# EAGLE design controller (EAGLE 6.2)
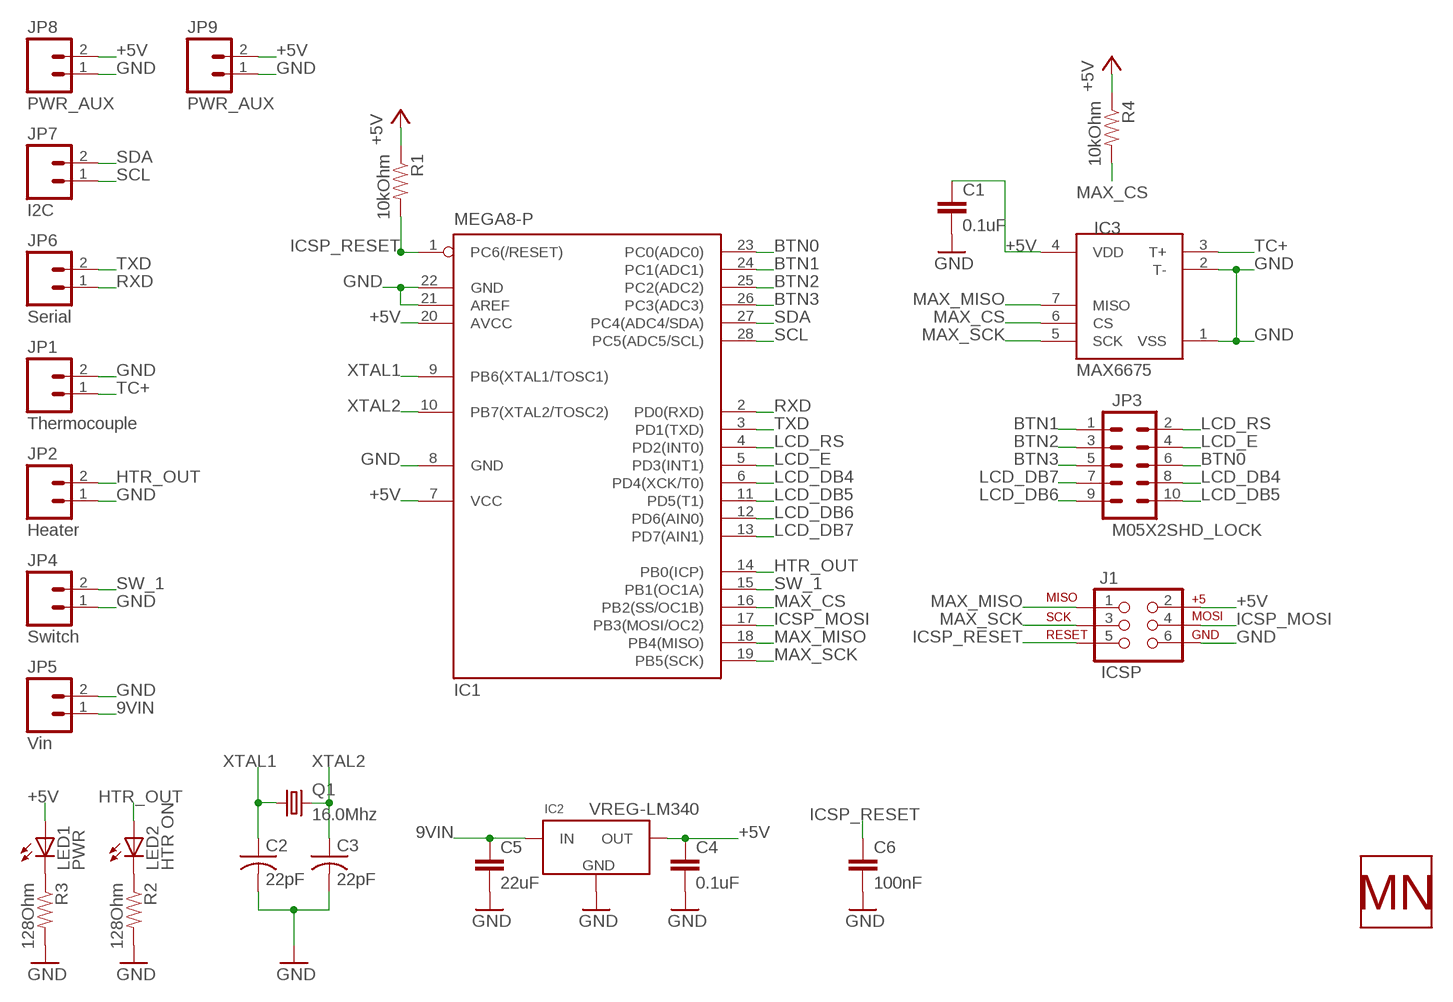
[diagram p0: schematic, sheet 1]

## Parts
C1  0.1uF  CAPPTH  [CAP-PTH-SMALL]
C2  22pF  C-US025-030X050  [C025-030X050]
C3  22pF  C-US025-030X050  [C025-030X050]
C4  0.1uF  CAPPTH  [CAP-PTH-SMALL]
C5  22uF  CAPPTH1  [CAP-PTH-5MM]
C6  100nF  CAP0603-CAP  [0603-CAP]
IC1  MEGA8-P  [DIL28-3]
IC2  VREG-LM340  [D2PACK/A]
IC3  MAX6675  [SO08-MAX6675]
J1  ICSP  AVR_SPI_PRG_6PTH  [2X3]
JP1  Thermocouple  M025MM  [SCREWTERMINAL-5MM-2]
JP2  Heater  M025MM  [SCREWTERMINAL-5MM-2]
JP3  M05X2SHD_LOCK  [2X5-SHROUDED_LOCK]
JP4  Switch  M025MM  [SCREWTERMINAL-5MM-2]
JP5  Vin  M025MM  [SCREWTERMINAL-5MM-2]
JP6  Serial  M02PTH  [1X02]
JP7  I2C  M02PTH  [1X02]
JP8  PWR_AUX  M02PTH  [1X02]
JP9  PWR_AUX  M02POLAR  [MOLEX-1X2]
LED1  PWR  LED-GREEN0603  [LED-0603]
LED2  HTR ON  LED-RED0603  [LED-0603]
Q1  16.0Mhz  CRYSTALHC49S  [HC49/S]
R1  10kOhm  RESISTOR1206  [1206]
R2  128Ohm  RESISTOR1206  [1206]
R3  128Ohm  RESISTOR1206  [1206]
R4  10kOhm  RESISTOR1206  [1206]
U$1  MN-LOGO  [MN-LOGO]

## Nets
9VIN [POWER]: C5.1 IC2.1(IN) JP5.1
+5V: C1.1 C4.1 IC1.7(VCC) IC1.20(AVCC) IC2.3(OUT) IC3.4(VDD) J1.2 JP8.2 JP9.2 LED1.A R1.1 R4.1
BTN0: IC1.23(PC0(ADC0)) JP3.6
BTN1: IC1.24(PC1(ADC1)) JP3.1
BTN2: IC1.25(PC2(ADC2)) JP3.3
BTN3: IC1.26(PC3(ADC3)) JP3.5
GND: C1.2 C2.2 C3.2 C4.2 C5.2 C6.2 IC1.8(GND) IC1.21(AREF) IC1.22(GND) IC2.2(GND) IC2.TAB(GND) IC3.1(VSS) IC3.2(T-) J1.6 JP1.2 JP2.1 JP4.1 JP5.2 JP8.1 JP9.1 R2.2 R3.2
HTR_OUT: IC1.14(PB0(ICP)) JP2.2 LED2.A
ICSP_MOSI: IC1.17(PB3(MOSI/OC2)) J1.4
ICSP_RESET: C6.1 IC1.1(PC6(/RESET)) J1.5 R1.2
LCD_DB4: IC1.6(PD4(XCK/T0)) JP3.8
LCD_DB5: IC1.11(PD5(T1)) JP3.10
LCD_DB6: IC1.12(PD6(AIN0)) JP3.9
LCD_DB7: IC1.13(PD7(AIN1)) JP3.7
LCD_E: IC1.5(PD3(INT1)) JP3.4
LCD_RS: IC1.4(PD2(INT0)) JP3.2
MAX_CS: IC1.16(PB2(SS/OC1B)) IC3.6(CS) R4.2
MAX_MISO: IC1.18(PB4(MISO)) IC3.7(MISO) J1.1
MAX_SCK: IC1.19(PB5(SCK)) IC3.5(SCK) J1.3
N$1: LED1.C R3.1
N$4: LED2.C R2.1
RXD: IC1.2(PD0(RXD)) JP6.1
SCL: IC1.28(PC5(ADC5/SCL)) JP7.1
SDA: IC1.27(PC4(ADC4/SDA)) JP7.2
SW_1: IC1.15(PB1(OC1A)) JP4.2
TC+: IC3.3(T+) JP1.1
TXD: IC1.3(PD1(TXD)) JP6.2
XTAL1: C2.1 IC1.9(PB6(XTAL1/TOSC1)) Q1.1
XTAL2: C3.1 IC1.10(PB7(XTAL2/TOSC2)) Q1.2

## Library data of the parts
C1 C4 = SparkFun-Passives:CAP: Capacitor Standard 0603 ceramic capacitor, and 0.1" leaded capacitor.
C2 C3 = rcl:C-US: CAPACITOR, American symbol
C5 C6 = SparkFun-Capacitors:CAP: Capacitor Standard 0603 ceramic capacitor, and 0.1" leaded capacitor.
IC1 = atmel:MEGA8-P: MICROCONTROLLER 8 Kbytes FLASH, 1 kbytes SRAM, 512 bytes EEPROM, USART, 4-channel 10 bit ADC, 2-channel 8 bit ADC Pin compatible with Atmega48, ATMega88, ATMega168 Source: avr.lbr; OC_FARNELL: unknown; OC_NEWARK: unknown
IC2 = Mikes-Power-IC:VREG-LM340
IC3 = SparkFun-AnalogIC:MAX6675: K-type thermocouple ADC, SPI output
J1 = SparkFun-Connectors:AVR_SPI_PRG_6: AVR ISP 6 Pin This is the reduced ISP connector for AVR programming. Common on Arduino. This footprint will take up less PCB space and can be used with a 10-pin to 6-pin adapter such as SKU: BOB-08508
JP1 JP2 JP4-JP9 = SparkFun-Connectors:M02: Header 2 Standard 2-pin 0.1" header. Use with straight break away headers (SKU : PRT-00116), right angle break away headers (PRT-00553), swiss pins (PRT-00743), machine pins (PRT-00117), and female headers (PRT-00115). Molex polarized connector foot print use with SKU : PRT-08233 with associated crimp pins and housings.
JP3 = SparkFun-Connectors:M05X2: Header 5x2 Standard 10-pin dual row 0.1" header. Commonly used with AVR-ISP. Use with Spark Fun Electronics SKU: PRT-00778
LED1 = SparkFun-LED:LED-GREEN: Various green LEDs 0603- DIO-00821 LARGE- DIO-00862 LILYPAD- DIO-09910; PROD_ID: DIO-00821; VALUE: GREEN
LED2 = SparkFun-LED:LED-RED: Assorted Red LEDs LilyPad 1206- DIO-09912 1206- DIO-00809 0603- DIO-00819; PROD_ID: DIO-00819; VALUE: RED
Q1 = crystal:CRYSTAL: CRYSTAL; OC_FARNELL: 1667008; OC_NEWARK: unknown
R1-R4 = SparkFun-Resistors:RESISTOR: Resistor Basic schematic elements and footprints for 0603, 1206, and PTH resistors.
U$1 = Mikes-Aesthetics:MN-LOGO: Simple Logo with my initials

## Net classes
0 default: width 0.254 mm, drill 0.508 mm, clearance 0.254 mm
1 POWER: width 0.406 mm, drill 0.508 mm, clearance 0.254 mm

## Board
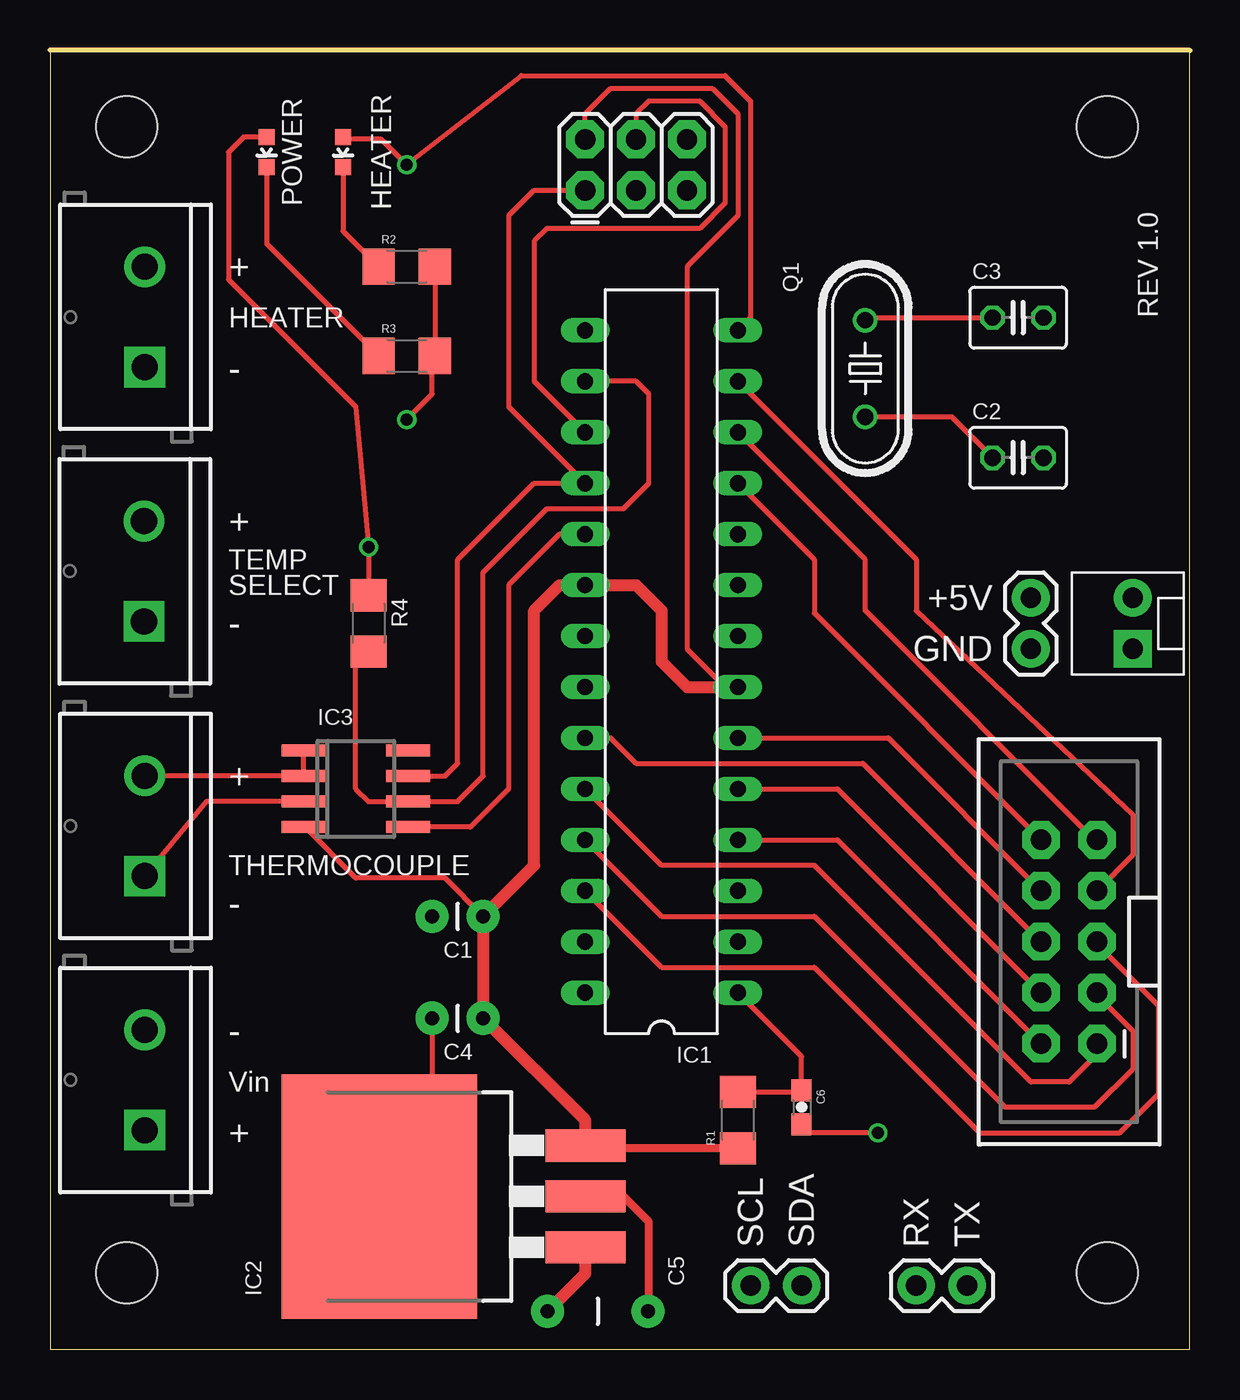
[diagram p1: board, top side]
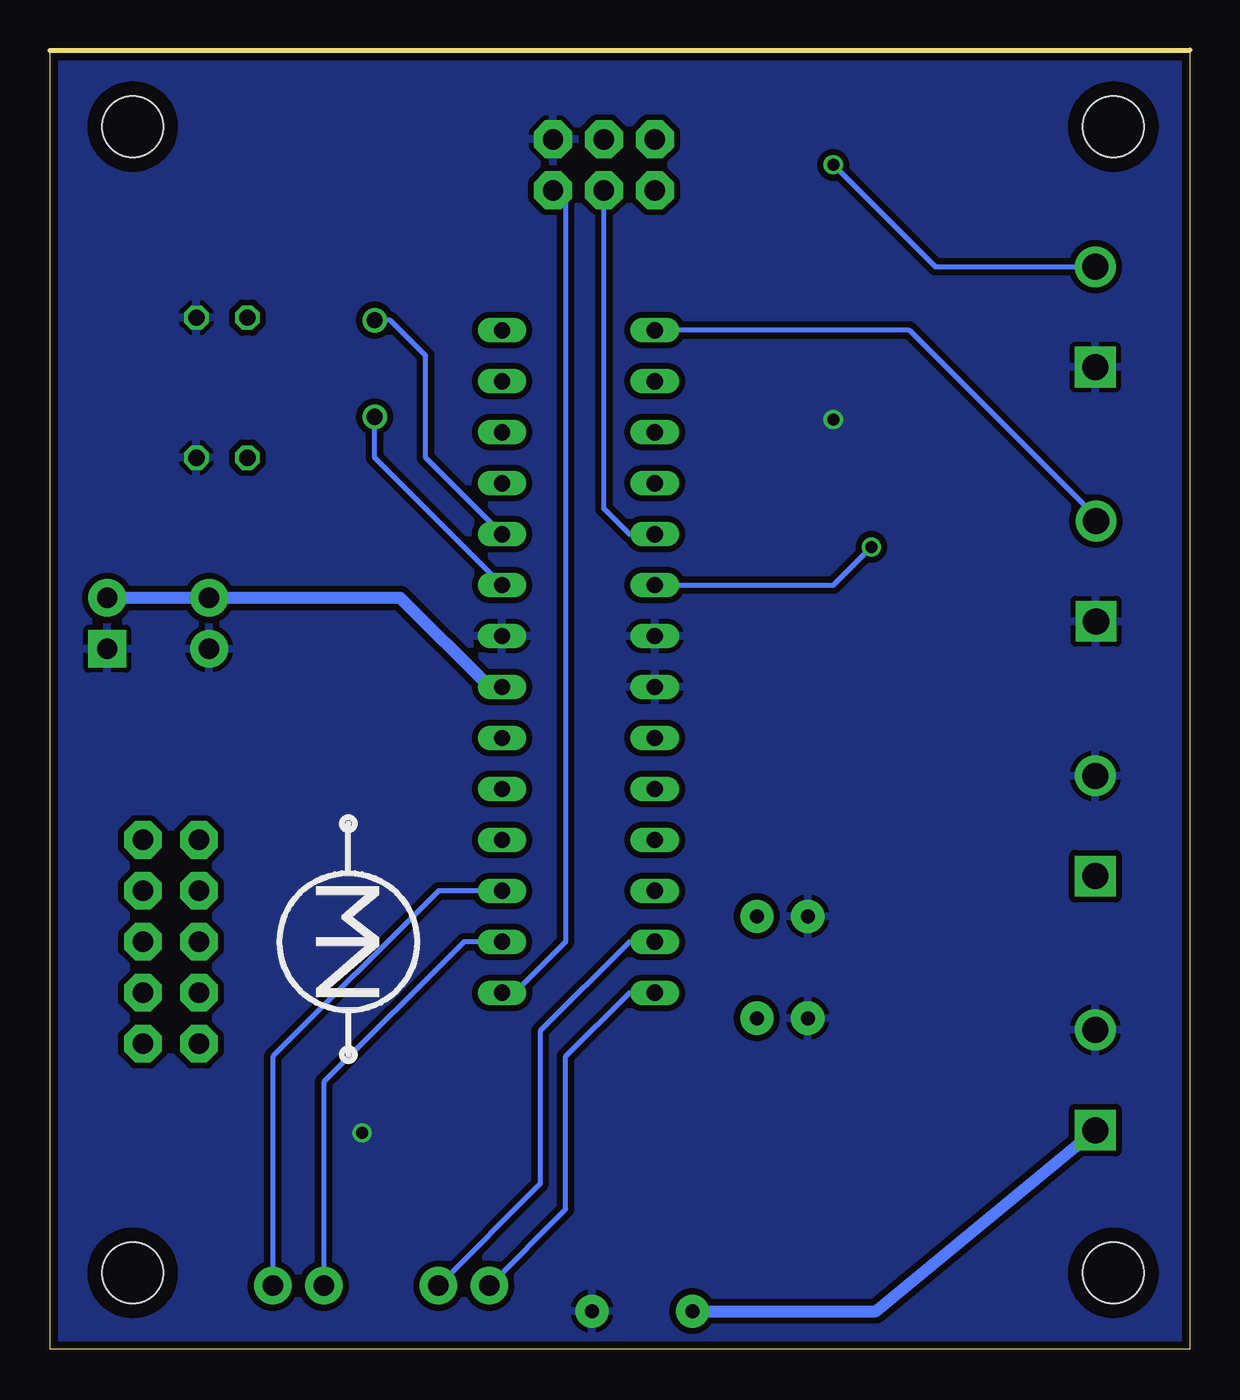
[diagram p2: board, bottom side, seen from below]

Size 56.82 x 64.77 mm. Coordinates in mm from the lower left corner, seen from the top.
Outline: 0,0 56.82,0 56.82,64.76 0,64.77 0,0
Copper layers (1*16): Top 0.0356mm / dielectric 1.5011mm / Bottom 0.0356mm
Design rules: minimum track width 6mil, minimum drill 13mil, track to track 6mil, track to pad 6mil, pad to pad 6mil, via to via 6mil, smd to smd 6mil, copper to edge 15mil, drill to drill 6mil, minimum pad ring 7mil, minimum via ring 7mil, stop-mask expansion 4mil, vias tented up to drill 0mil, thermal gap 10mil

### Footprints (pad centres in the part's own frame; a part is rotated, then mirrored left to right if it is on the bottom)
CAP-PTH-SMALL = drill 0.7 pad 1.651: 1 0,0; 2 2.54,0
C025-030X050 = drill 0.813 octagon: 1 -1.27,0; 2 1.27,0
CAP-PTH-5MM = drill 0.7 pad 1.651: 1 -2.5,0; 2 2.5,0
0603-CAP = smd 1.1 x 1: 1 -0.85,0; 2 0.85,0
DIL28-3 = drill 0.813 long: 1 -16.51,-3.81; 2 -13.97,-3.81; 3 -11.43,-3.81; 4 -8.89,-3.81; 5 -6.35,-3.81; 6 -3.81,-3.81; 7 -1.27,-3.81; 8 1.27,-3.81; 9 3.81,-3.81; 10 6.35,-3.81; 11 8.89,-3.81; 12 11.43,-3.81; 13 13.97,-3.81; 14 16.51,-3.81; 15 16.51,3.81; 16 13.97,3.81; 17 11.43,3.81; 18 8.89,3.81; 19 6.35,3.81; 20 3.81,3.81; 21 1.27,3.81; 22 -1.27,3.81; 23 -3.81,3.81; 24 -6.35,3.81; 25 -8.89,3.81; 26 -11.43,3.81; 27 -13.97,3.81; 28 -16.51,3.81
D2PACK/A = smd 1.6 x 4: 1 -2.54,-8.275; 2 0,-8.275; 3 2.54,-8.275 | smd 12.2 x 9.75: TAB 0,2
SO08-MAX6675 = smd 0.6 x 2.2: 1 -1.905,-2.6; 2 -0.635,-2.6; 3 0.635,-2.6; 4 1.905,-2.6; 5 1.905,2.6; 6 0.635,2.6; 7 -0.635,2.6; 8 -1.905,2.6
2X3 = drill 1.016 pad 1.88 octagon: 1 0,0; 2 0,2.54; 3 2.54,0; 4 2.54,2.54; 5 5.08,0; 6 5.08,2.54
SCREWTERMINAL-5MM-2 = drill 1.3 pad 2.032 square: 1 0,0 | drill 1.3 pad 2.032: 2 5,0
2X5-SHROUDED_LOCK = drill 1.016 pad 1.88 octagon: 1 -1.397,5.08; 2 1.397,5.08; 3 -1.397,2.54; 4 1.397,2.54; 5 -1.397,0; 6 1.397,0; 7 -1.397,-2.54; 8 1.397,-2.54; 9 -1.397,-5.08; 10 1.397,-5.08
1X02 = drill 1.016 pad 1.88: 1 0,0; 2 2.54,0
MOLEX-1X2 = drill 1.016 pad 1.88 square: 1 0,0 | drill 1.016 pad 1.88: 2 2.54,0
LED-0603 = smd 0.8 x 0.8: A 0,-0.75; C 0,0.75
HC49/S = drill 0.813: 1 -2.413,0; 2 2.413,0
1206 = smd 1.6 x 1.8: 1 -1.4,0; 2 1.4,0
STAND-OFF-TIGHT = hole 3.048: 0,0

### Placement (x,y rotation side)
C1  21.59,21.59 180 top
C2  48.26,44.45 0 top
C3  48.26,51.44 0 top
C4  21.59,16.51 180 top
C5  27.3,1.91 0 top
C6  37.47,12.06 270 top
IC1  30.48,34.29 90 top
IC2  18.41,7.62 90 top
IC3  15.24,27.94 270 top
J1  26.67,57.78 0 top
JP1  4.71,23.59 90 top
JP2  4.71,48.97 90 top
JP3  50.8,20.32 180 top
JP4  4.68,36.29 90 top
JP5  4.71,10.93 90 top
JP6  43.18,3.17 0 top
JP7  34.92,3.17 0 top
JP8  48.9,34.92 90 top
JP9  53.98,34.92 90 top
LED1  10.79,59.69 180 top
LED2  14.61,59.69 180 top
Q1  40.64,48.9 90 top
R1  34.29,11.43 90 top
R2  17.78,53.98 0 top
R3  17.78,49.53 0 top
R4  15.88,36.2 270 top
U$1  41.91,20.32 270 bottom
U$2  [STAND-OFF-TIGHT]  3.81,60.96 0 top
U$3  [STAND-OFF-TIGHT]  3.81,3.81 0 top
U$4  [STAND-OFF-TIGHT]  52.7,60.96 0 top
U$5  [STAND-OFF-TIGHT]  52.7,3.81 90 top

### Tracks (layer width: path | path; a pad name or v marks a point on that pad's centre or on a via)
9VIN
  Top 0.61: C5.1 26.69,3.79 IC2.1
  Bottom 0.61: C5.1 15.64,1.91 JP5.1
+5V  (via drill 0.6)
  Top 0.254: C1.1 19.68,23.5 15.24,23.5 12.7,26.04 IC3.4 | R4.1 v15.88,40.01 15.24,46.99 8.89,53.34 8.89,59.69 9.64,60.44 LED1.A | J1.2 26.67,61.59 27.94,62.87 33.02,62.87 34.29,61.59 34.29,56.52 31.75,53.98 31.75,34.92 33.66,33.02
  Top 0.406: R1.1 26.82,10.03 IC2.3
  Top 0.61: IC1.7 33.66,33.02 31.75,33.02 30.48,34.29 30.48,36.83 29.21,38.1 IC1.20 25.4,38.1 24.13,36.83 24.13,24.13 C1.1 C4.1 26.69,11.41 IC2.3
  Bottom 0.254: IC1.20 17.78,38.1 v15.88,40.01
  Bottom 0.61: IC1.7 34.92,33.02 39.37,37.47 JP8.2 JP9.2
BTN0
  Top 0.254: IC1.23 27.94,30.48 29.21,29.21 40.51,29.21 JP3.6
BTN1
  Top 0.254: JP3.1 52.2,14.73 50.8,13.34 48.9,13.34 38.1,24.13 30.48,24.13 IC1.24
BTN2
  Top 0.254: IC1.25 30.48,21.59 38.1,21.59 47.62,12.06 52.07,12.06 53.98,13.97 53.98,15.88 52.2,17.65 JP3.3
BTN3
  Top 0.254: IC1.26 30.48,19.05 38.1,19.05 46.35,10.79 53.34,10.79 55.24,12.7 55.24,17.14 52.2,20.19 JP3.5
GND  (via drill 0.6)
  Top 0.254: C4.2 19.05,8.89 16.51,6.35 16.51,7.53 IC2.TAB | C5.2 29.84,1.95 | 28.57,7.62 IC2.2 | IC3.1 IC3.2 5.37,28.57 JP1.2 | R2.2 R3.2 19.05,49.4 19.05,47.62 v17.78,46.35 | v41.27,10.79 37.88,10.79 C6.2
  Top 0.406: 29.84,1.95 29.84,6.35 28.57,7.62
  pour Bottom (isolate 0.305): -0.64,65.41 57.78,65.41 57.78,-0.64 -0.64,-0.64
HTR_OUT  (via drill 0.6)
  Top 0.254: LED2.A 14.72,60.33 16.51,60.33 v17.78,59.05 23.5,63.5 33.66,63.5 34.92,62.23 34.92,51.44 IC1.14
  Bottom 0.254: v17.78,59.05 12.69,53.97 JP2.2
ICSP_MOSI
  Top 0.254: IC1.17 24.13,48.26 24.13,55.24 24.77,55.88 32.38,55.88 33.66,57.15 33.66,60.96 32.38,62.23 29.84,62.23 29.21,61.59 J1.4
ICSP_RESET
  Top 0.254: IC1.1 37.47,14.61 C6.1 37.38,12.83 R1.2
  Bottom 0.254: IC1.1 33.66,17.78 31.11,20.32 31.11,57.15 J1.5
LCD_DB4
  Top 0.254: IC1.6 41.78,30.48 JP3.8
LCD_DB5
  Top 0.254: IC1.11 38.1,39.37 38.1,36.7 JP3.10
LCD_DB6
  Top 0.254: JP3.9 52.07,25.4 40.64,36.83 40.64,39.37 IC1.12
LCD_DB7
  Top 0.254: IC1.13 43.18,39.37 43.18,36.83 53.98,26.67 53.98,24.64 JP3.7
LCD_E
  Top 0.254: IC1.5 39.24,27.94 JP3.4
LCD_RS
  Top 0.254: IC1.4 39.24,25.4 JP3.2
MAX_CS
  Top 0.254: IC1.16 29.21,48.26 29.84,47.62 29.84,43.18 28.57,41.91 24.77,41.91 21.59,38.73 21.59,28.57 20.32,27.3 IC3.6 15.88,27.3 15.24,27.94 15.24,34.16 R4.2
MAX_MISO
  Top 0.254: IC3.7 19.68,28.57 20.32,29.21 20.32,39.37 24.13,43.18 IC1.18 22.86,46.99 22.86,56.52 24.13,57.78 J1.1
MAX_SCK
  Top 0.254: IC1.19 25.4,40.64 22.86,38.1 22.86,27.94 20.95,26.04 IC3.5
  Bottom 0.254: IC1.19 27.94,40.64 29.21,41.91 J1.3
N$1
  Top 0.254: LED1.C 10.79,55.12 R3.1
N$4
  Top 0.254: LED2.C 14.61,55.75 R2.1
RXD
  Bottom 0.254: IC1.2 36.2,20.32 43.18,13.34 JP6.1
SCL
  Bottom 0.254: JP7.1 31.11,6.99 31.11,14.61 27.94,17.78 IC1.28
SDA
  Bottom 0.254: IC1.27 27.94,20.32 32.38,15.88 32.38,8.26 JP7.2
SW_1
  Bottom 0.254: IC1.15 13.97,50.8 4.68,41.51 JP4.2
TC+
  Top 0.254: IC3.3 7.79,27.3 JP1.1
TXD
  Bottom 0.254: IC1.3 37.47,22.86 45.72,14.61 JP6.2
XTAL1
  Top 0.254: C2.1 44.96,46.48 Q1.1
  Bottom 0.254: IC1.9 40.64,44.45 Q1.1
XTAL2
  Top 0.254: Q1.2 40.77,51.44 C3.1
  Bottom 0.254: IC1.10 38.1,44.45 38.1,49.53 39.88,51.31 Q1.2

### Text on the board
tNames: POWER | HEATER | + | HEATER | REV 1.0 | - | + | TEMP | SELECT | +5V | - | GND | + | THERMOCOUPLE | - | - | Vin | + | SCL | SDA | RX | TX